# EAGLE schematic MiniSumoMotors (EAGLE 9.6.2)
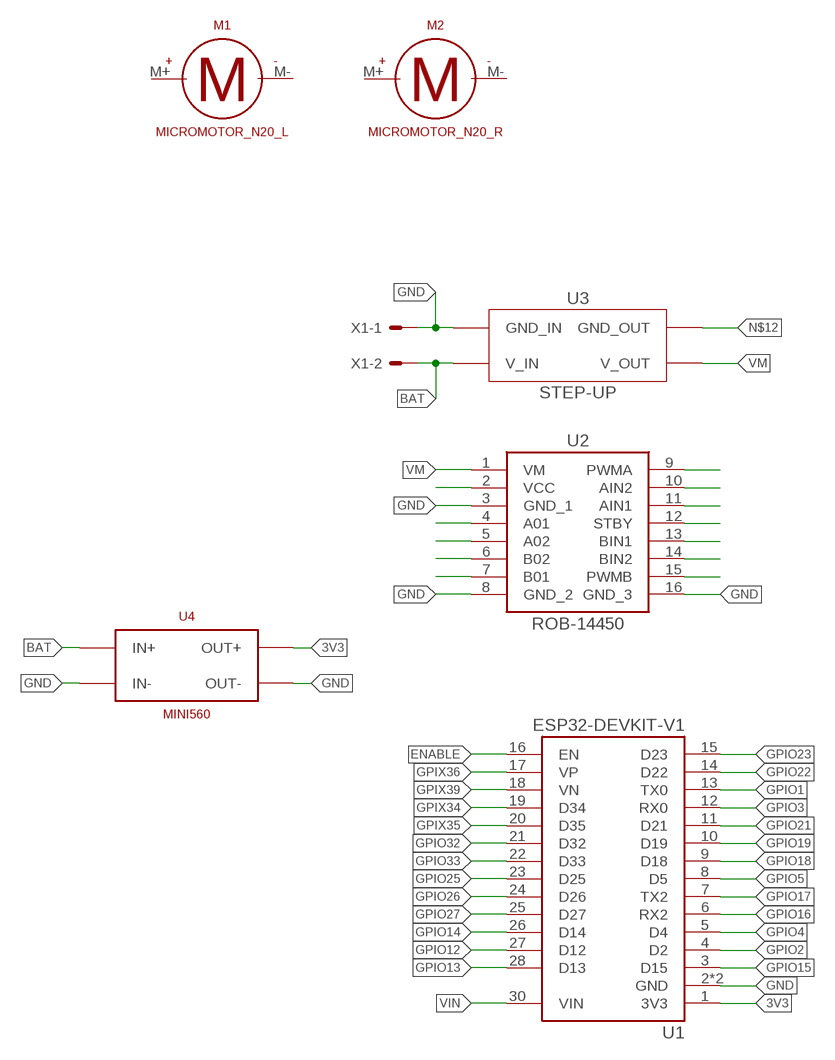
[diagram p0: schematic, sheet 1]

## Parts
M1  MICROMOTOR_N20_L  [MICROMOTOR-L]
M2  MICROMOTOR_N20_R  [MICROMOTOR-R]
U1  ESP32-DEVKIT-V1  [MODULE_ESP32_DEVKIT_V1]
U2  ROB-14450  [ROB14450]
U3  STEP-UP  [STEP-UP]
U4  MINI560  [MINI560]
X1  22-23-2021  [22-23-2021]

## Nets
3V3: U1.1(3V3) U4.P$11(OUT+) U4.P$12(OUT+) U4.P$15(OUT+) U4.P$16(OUT+)
BAT: U3.V_IN U4.P$3(IN+) U4.P$4(IN+) U4.P$7(IN+) U4.P$8(IN+) X1.2
ENABLE: U1.16(EN)
GND: U1.2(GND) U1.29(GND) U2.3(GND_1) U2.8(GND_2) U2.16(GND_3) U3.GND_IN U4.P$1(IN-) U4.P$2(IN-) U4.P$5(IN-) U4.P$6(IN-) U4.P$9(OUT-) U4.P$10(OUT-) U4.P$13(OUT-) U4.P$14(OUT-) X1.1
GPIO1: U1.13(TX0)
GPIO2: U1.4(D2)
GPIO3: U1.12(RX0)
GPIO4: U1.5(D4)
GPIO5: U1.8(D5)
GPIO12: U1.27(D12)
GPIO13: U1.28(D13)
GPIO14: U1.26(D14)
GPIO15: U1.3(D15)
GPIO16: U1.6(RX2)
GPIO17: U1.7(TX2)
GPIO18: U1.9(D18)
GPIO19: U1.10(D19)
GPIO21: U1.11(D21)
GPIO22: U1.14(D22)
GPIO23: U1.15(D23)
GPIO25: U1.23(D25)
GPIO26: U1.24(D26)
GPIO27: U1.25(D27)
GPIO32: U1.21(D32)
GPIO33: U1.22(D33)
GPIX34: U1.19(D34)
GPIX35: U1.20(D35)
GPIX36: U1.17(VP)
GPIX39: U1.18(VN)
N$1: U2.4(A01)
N$2: U2.5(A02)
N$3: U2.6(B02)
N$4: U2.7(B01)
N$5: U2.9(PWMA)
N$6: U2.10(AIN2)
N$7: U2.11(AIN1)
N$8: U2.12(STBY)
N$9: U2.13(BIN1)
N$10: U2.14(BIN2)
N$11: U2.15(PWMB)
N$12: U3.GND_OUT
N$13: U2.2(VCC)
VIN: U1.30(VIN)
VM: U2.1(VM) U3.V_OUT
Unconnected: M1.M+ M1.M- M2.M+ M2.M-

## Library data of the parts
M1 M2 = Boards:MICROMOTOR_N20
U1 = Boards:ESP32-DEVKIT-V1: Dual core, Wi-Fi: 2.4 GHz up to 150 Mbits/s,BLE (Bluetooth Low Energy) and legacy Bluetooth, 32 bits, Up to 240 MHz Check availability <https://pricing.snapeda.com/parts/ESP32-DEVKIT-V1/Do%20it/view-part?ref=eda>; AVAILABILITY: Not in stock; DESCRIPTION: Dual core, Wi-Fi: 2.4 GHz up to 150 Mbits/s,BLE (Bluetooth Low Energy) and legacy Bluetooth, 32 bits, Up to 240 MHz; MF: Do it; MP: ESP32-DEVKIT-V1; PACKAGE: None; PRICE: None
U2 = Boards:ROB-14450: Power Management IC Development Tools SparkFun MotorDriver Dual TB6612FNG Head. Source: Datasheet <https://www.sparkfun.com/products/14450>; ARROW_PART_NUMBER: ROB-14450; ARROW_PRICE-STOCK: https://www.arrow.com/en/products/rob-14450/sparkfun-electronics?region=nac; DESCRIPTION: Power Management IC Development Tools SparkFun MotorDriver Dual TB6612FNG Head.; HEIGHT: 5mm; MANUFACTURER_NAME: SparkFun; MANUFACTURER_PART_NUMBER: ROB-14450; MOUSER_PART_NUMBER: 474-ROB-14450; MOUSER_PRICE-STOCK: https://www.mouser.co.uk/ProductDetail/SparkFun/ROB-14450?qs=wd5RIQLrsJhQdlH%2FW5H2aQ%3D%3D
U3 = Boards:STEP-UP
U4 = Boards:MINI560
X1 = Pines:22-23-2021: .100" (2.54mm) Center Header - 2 Pin; MF: MOLEX; MPN: 22-23-2021; OC_FARNELL: 1462926; OC_NEWARK: 25C3832